# EAGLE design MicroMySens-v003 (EAGLE 7.3.0)
MAPLE-CUx Large Version
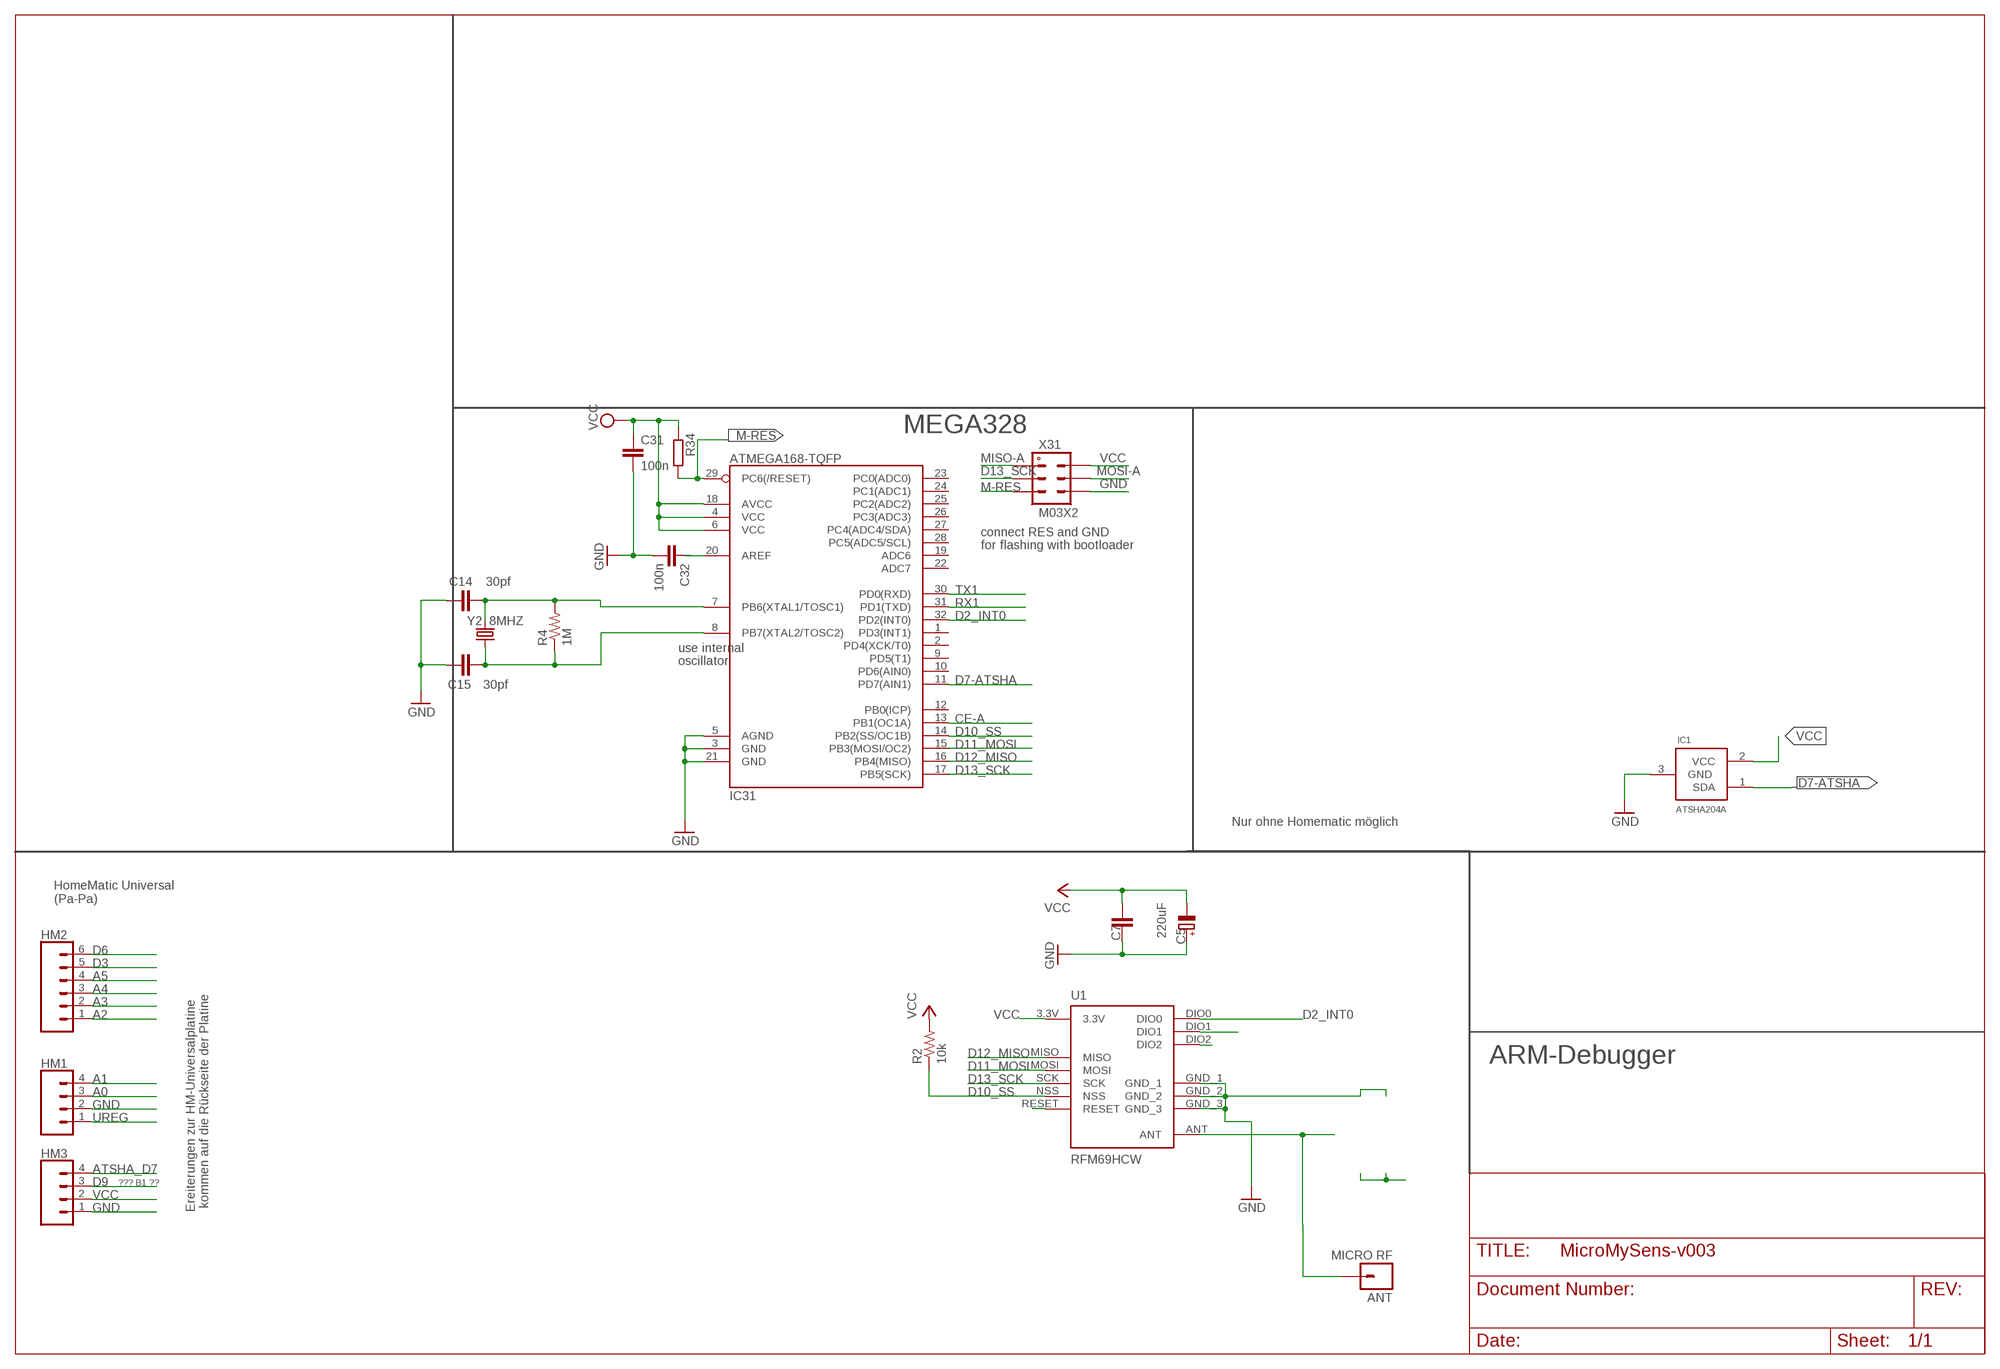
[diagram p0: schematic, sheet 1]

## Parts
ANT  MICRO RF  M01PTH  [1X01]
C5  220uF  CPOL-EUE5-8.5  [E5-8,5]
C7  C-EUC1812  [C1812]
C14  30pf  CAP0805  [0805]
C15  30pf  CAP0805  [0805]
C31  100n  C-EUC0805  [C0805]
C32  100n  C-EUC0805  [C0805]
HM1  CONN_04  [1X04]
HM2  CONN_06SILK_FEMALE_PTH  [1X06]
HM3  CONN_04  [1X04]
IC1  ATSHA204A  [SOT23]
IC31  ATMEGA168-TQFP  [TQFP32-08]
R2  10k  RESISTOR0805-RES  [0805]
R4  1M  RESISTOR0805-RES  [0805]
R34  R-EU_R0805  [R0805]
U1  RFM69HCW  [RFM69HCW-XXXS2]
X31  M03X2  [2X03-1.27MM_SMD]
Y2  8MHZ  CRYSTALTXC-7A  [CRYSTAL-TXC-7A]

## Nets
A0: HM1.3
A1: HM1.4
A2: HM2.1
A3: HM2.2
A4: HM2.3
A5: HM2.4
ANT: ANT.1 U1.ANT
ATSHA_D7: HM3.4
CE-A: IC31.13(PB1(OC1A))
D2_INT0: IC31.32(PD2(INT0)) U1.DIO0
D3: HM2.5
D6: HM2.6
D7-ATSHA: IC1.1(SDA) IC31.11(PD7(AIN1))
D9: HM3.3
D10_SS: IC31.14(PB2(SS/OC1B)) R2.1 U1.NSS
D11_MOSI: IC31.15(PB3(MOSI/OC2)) U1.MOSI
D12_MISO: IC31.16(PB4(MISO)) U1.MISO
D13_SCK: IC31.17(PB5(SCK)) U1.SCK X31.P$3
GND [PWR]: C5.+ C7.2 C14.1 C15.1 C31.2 C32.2 HM1.2 HM3.1 IC1.3(GND) IC31.3(GND) IC31.5(AGND) IC31.21(GND) U1.GND_1 U1.GND_2 U1.GND_3 X31.P$6
M-RES: IC31.29(PC6(/RESET)) R34.2 X31.P$5
MISO-A: X31.P$1
MOSI-A: X31.P$4
N$3: C14.2 IC31.7(PB6(XTAL1/TOSC1)) R4.2 Y2.P$2
N$13: C32.1 IC31.20(AREF)
N$14: U1.DIO2
N$15: U1.DIO1
N$16: U1.RESET
N$19: C15.2 IC31.8(PB7(XTAL2/TOSC2)) R4.1 Y2.P$1
RX1: IC31.31(PD1(TXD))
TX1: IC31.30(PD0(RXD))
UREG [PWR]: HM1.1
VCC [PWR]: C5.- C7.1 C31.1 HM3.2 IC1.2(VCC) IC31.4(VCC) IC31.6(VCC) IC31.18(AVCC) R2.2 R34.1 U1.3.3V X31.P$2
Unconnected: IC31.1(PD3(INT1)) IC31.2(PD4(XCK/T0)) IC31.9(PD5(T1)) IC31.10(PD6(AIN0)) IC31.12(PB0(ICP)) IC31.19(ADC6) IC31.22(ADC7) IC31.23(PC0(ADC0)) IC31.24(PC1(ADC1)) IC31.25(PC2(ADC2)) IC31.26(PC3(ADC3)) IC31.27(PC4(ADC4/SDA)) IC31.28(PC5(ADC5/SCL))

## Notes on the sheet
- MEGA328
- connect RES and GND
- for flashing with bootloader
- use internal
- oscillator
- Nur ohne Homematic möglich
- HomeMatic Universal
  (Pa-Pa)
- ARM-Debugger
- ??? B1 ??
- Ereiterungen zur HM-Universalplatine
   kommen auf die Rückseite der Platine

## Library data of the parts
ANT = SparkFun-Connectors:M01: Header 1 Standard 1-pin 0.1" header. Use with straight break away headers (SKU : PRT-00116), right angle break away headers (PRT-00553), swiss pins (PRT-00743), machine pins (PRT-00117), and female headers (PRT-00115).
C5 = rcl:CPOL-EU: POLARIZED CAPACITOR, European symbol
C7 C31 C32 = rcl:C-EU: CAPACITOR, European symbol
C14 C15 = doug:CAP: Capacitor Standard 0603 ceramic capacitor, and 0.1" leaded capacitor.
HM1 HM3 = SparkFun-Connectors:CONN_04: Multi connection point. Often used as Generic Header-pin footprint for 0.1 inch spaced/style header connections On any of the 0.1 inch spaced packages, you can populate with these: Break Away Headers - Straight <https://www.sparkfun.com/products/116> (PRT-00116) Break Away Male Headers - Right Angle <https://www.sparkfun.com/products/553> (PRT-00553) Female Headers <https://www.sparkfun.com/products/115> (PRT-00115) Break Away Headers - Machine Pin <https://www.sparkfun.com/products/117> (PRT-00117) Break Away Female Headers - Swiss Machine Pin <https://www.sparkfun.com/products/743> (PRT-00743) For SCREWTERMINALS and SPRING TERMINALS visit here: Screw Terimnals on SparkFun.com <https://www.sparkfun.com/search/results?term=Screw+Terminals> (5mm/3.5mm/2.54mm spacing) This device is also useful as a general connection point to wire up your design to another part of your project. Our various solder wires solder well into these plated through hole pads. Hook-Up Wire - Assortment (Stranded, 22 AWG) <https://www.sparkfun.com/products/11375> (PRT-11375) Hook-Up Wire - Assortment (Solid Core, 22 AWG) <https://www.sparkfun.com/products/11367> (PRT-11367) View the entire wire category on our website here <https://www.sparkfun.com/categories/141> Special notes: Molex polarized connector foot print use with SKU : PRT-08231 with associated crimp pins and housings. 1MM SMD Version SKU: PRT-10208; PROD_ID: CONN-09696
HM2 = SparkFun-Connectors:CONN_06: Multi connection point. Often used as Generic Header-pin footprint for 0.1 inch spaced/style header connections On any of the 0.1 inch spaced packages, you can populate with these: Break Away Headers - Straight <https://www.sparkfun.com/products/116> (PRT-00116) Break Away Male Headers - Right Angle <https://www.sparkfun.com/products/553> (PRT-00553) Female Headers <https://www.sparkfun.com/products/115> (PRT-00115) Break Away Headers - Machine Pin <https://www.sparkfun.com/products/117> (PRT-00117) Break Away Female Headers - Swiss Machine Pin <https://www.sparkfun.com/products/743> (PRT-00743) Arduino Stackable Header - 6 Pin <https://www.sparkfun.com/products/9280> (PRT-09280) For SCREWTERMINALS and SPRING TERMINALS visit here: Screw Terimnals on SparkFun.com <https://www.sparkfun.com/search/results?term=Screw+Terminals> (5mm/3.5mm/2.54mm spacing) This device is also useful as a general connection point to wire up your design to another part of your project. Our various solder wires solder well into these plated through hole pads. Hook-Up Wire - Assortment (Stranded, 22 AWG) <https://www.sparkfun.com/products/11375> (PRT-11375) Hook-Up Wire - Assortment (Solid Core, 22 AWG) <https://www.sparkfun.com/products/11367> (PRT-11367) View the entire wire category on our website here <https://www.sparkfun.com/categories/141>; PROD_ID: CONN-08437
IC1 = Sensor:ATSHA204A
IC31 = atmel:ATMEGA168: Atmel Atmega 168/328/328P
R2 R4 = doug:RESISTOR: Resistor Basic schematic elements and footprints for 0603, 1206, and PTH resistors.
R34 = rcl:R-EU_: RESISTOR, European symbol
U1 = doug:RFM69H
X31 = mechanics:M03X2
Y2 = SparkFun-FreqCtrl:CRYSTAL: Various standard crystals. Proven footprints.

## Net classes
0 default: width 0.305 mm
1 PWR: width 0.457 mm

## Board
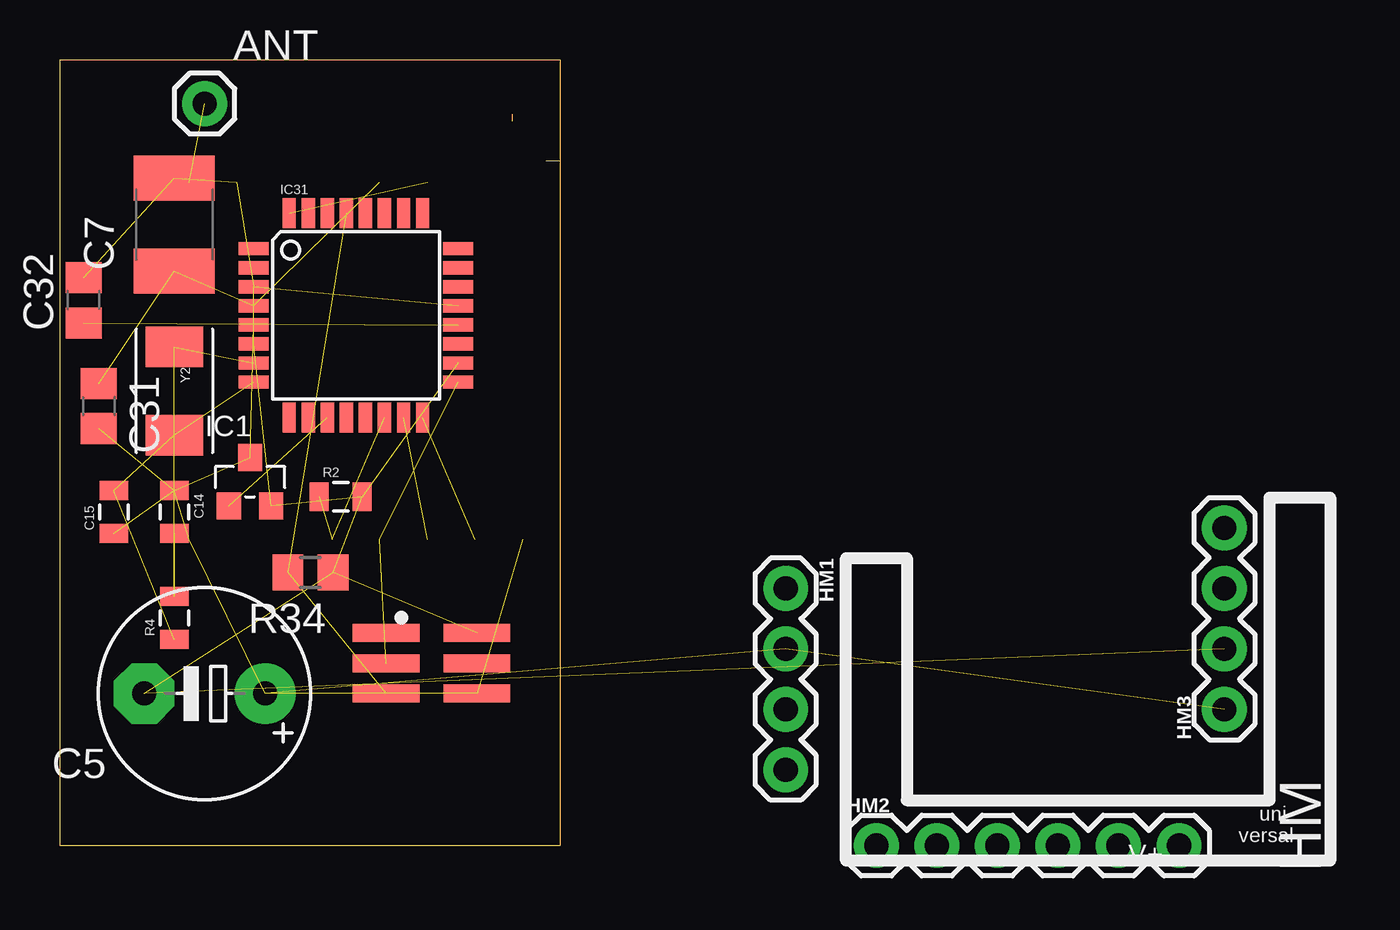
[diagram p1: board, top side]
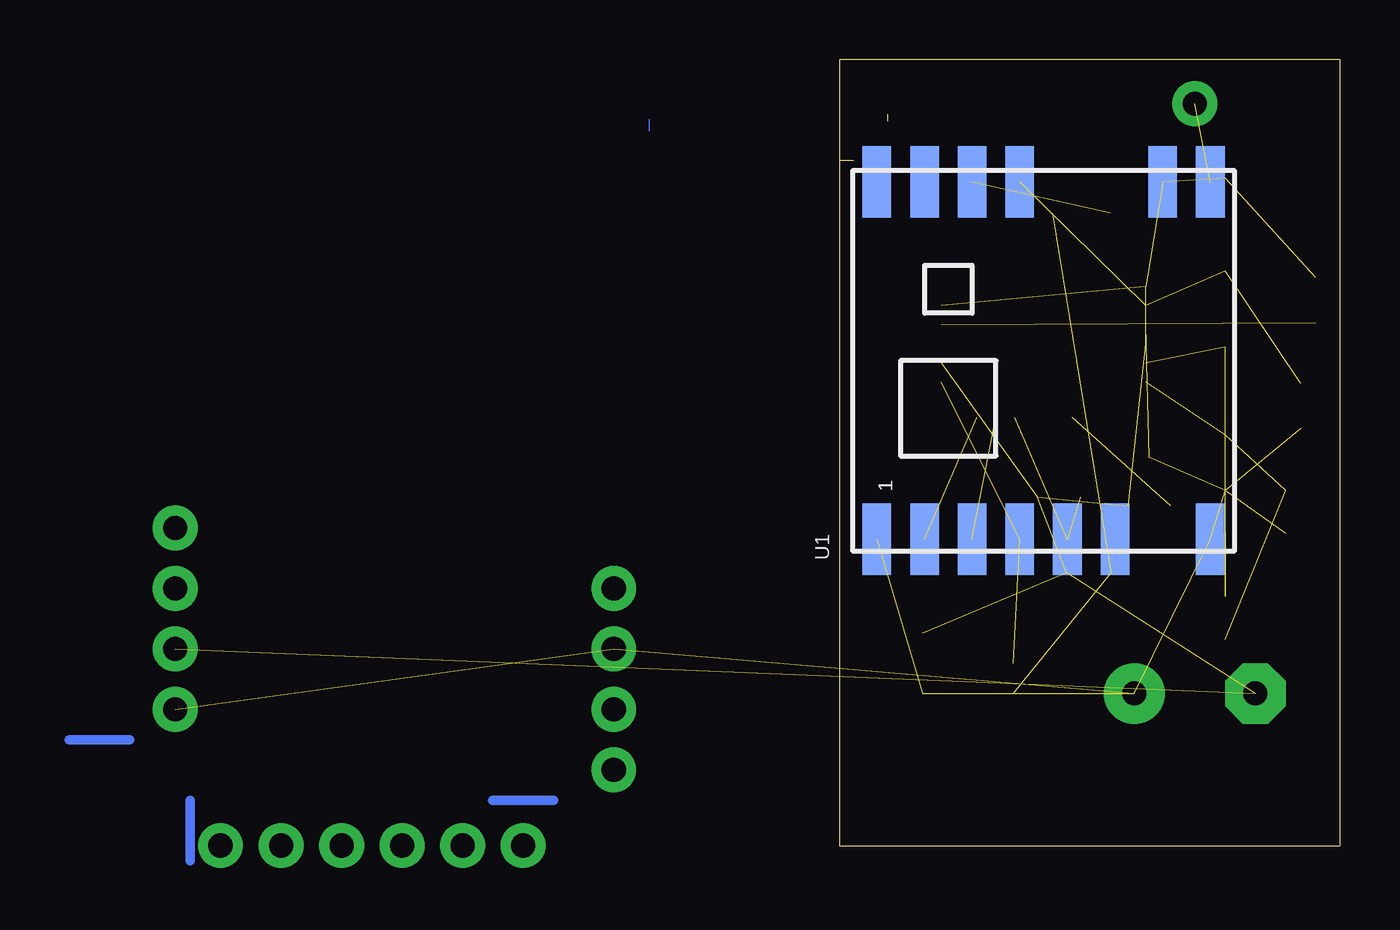
[diagram p2: board, bottom side, seen from below]

Size 21 x 33 mm. Coordinates in mm from the lower left corner, seen from the top.
Outline: 21,33 21,32.24
Outline: 19,30.7 19,30.41
Outline: 20.41,28.75 21,28.75
Outline: 21,33 0,33 0,0 21,0 21,28.75
Outline: 21,33 21,28.75
Copper layers (1*16): Top 0.035mm / dielectric 1.5mm / Bottom 0.035mm
Design rules "SeeedStudio_2layer_DRU_no_angle_20140221": minimum track width 6mil, minimum drill 12mil, track to track 6mil, track to pad 6mil, pad to pad 6mil, via to via 6mil, smd to smd 0mil, copper to edge 10mil, drill to drill 10mil, minimum pad ring 10mil, minimum via ring 6mil, stop-mask expansion 2mil, vias tented up to drill 100mil, thermal gap 10mil

### Footprints (pad centres in the part's own frame; a part is rotated, then mirrored left to right if it is on the bottom)
1X01 = drill 1.016 pad 1.88: 1 0,0
E5-8,5 = drill 1.016 pad 2.54: + -2.54,0 | drill 1.016 pad 2.54 octagon: - 2.54,0
C1812 = smd 1.9 x 3.4: 1 -1.95,0; 2 1.95,0
0805 = smd 0.8 x 1.2: 1 -0.9,0; 2 0.9,0
C0805 = smd 1.3 x 1.5: 1 -0.95,0; 2 0.95,0
1X04 = drill 1.016 pad 1.88: 1 0,0; 2 2.54,0; 3 5.08,0; 4 7.62,0
1X06 = drill 1.016 pad 1.88: 1 0,0; 2 2.54,0; 3 5.08,0; 4 7.62,0; 5 10.16,0; 6 12.7,0
SOT23 = smd 1.016 x 1.143: 1 -0.889,-1.016; 2 0.889,-1.016; 3 0,1.016
TQFP32-08 = smd 1.27 x 0.559: 1 -4.293,2.8; 2 -4.293,2; 3 -4.293,1.2; 4 -4.293,0.4; 5 -4.293,-0.4; 6 -4.293,-1.2; 7 -4.293,-2; 8 -4.293,-2.8; 17 4.293,-2.8; 18 4.293,-2; 19 4.293,-1.2; 20 4.293,-0.4; 21 4.293,0.4; 22 4.293,1.2; 23 4.293,2; 24 4.293,2.8 | smd 0.559 x 1.27: 9 -2.8,-4.293; 10 -2,-4.293; 11 -1.2,-4.293; 12 -0.4,-4.293; 13 0.4,-4.293; 14 1.2,-4.293; 15 2,-4.293; 16 2.8,-4.293; 25 2.8,4.293; 26 2,4.293; 27 1.2,4.293; 28 0.4,4.293; 29 -0.4,4.293; 30 -1.2,4.293; 31 -2,4.293; 32 -2.8,4.293
R0805 = smd 1.3 x 1.5: 1 -0.95,0; 2 0.95,0
RFM69HCW-XXXS2 = smd 3 x 1.2: 3.3V 7.5,1; ANT 7.5,-7; DIO0 7.5,3; DIO1 7.5,5; DIO2 7.5,7; GND_1 7.5,-5; GND_2 -7.5,-7; GND_3 -7.5,7; MISO -7.5,5; MOSI -7.5,3; NSS -7.5,-1; RESET -7.5,-3; SCK -7.5,1
2X03-1.27MM_SMD = smd 0.75 x 2.8: P$1 -1.27,-1.905; P$2 -1.27,1.905; P$3 0,-1.905; P$4 0,1.905; P$5 1.27,-1.905; P$6 1.27,1.905
CRYSTAL-TXC-7A = smd 1.7 x 2.4: P$1 1.85,0; P$2 -1.85,0

### Placement (x,y rotation side)
ANT  6.09,31.15 0 top
C5  6.09,6.38 180 top
C7  4.82,26.07 90 top
C14  4.82,14.01 270 top
C15  2.28,14.01 90 top
C31  1.65,18.45 270 top
C32  1.01,22.89 90 top
HM1  30.48,10.79 270 top  (outside the outline)
HM2  34.29,0 0 top  (outside the outline)
HM3  48.9,5.71 90 top  (outside the outline)
IC1  8,15.28 0 top
IC31  12.44,22.26 0 top
R2  11.8,14.64 0 top
R4  4.82,9.56 90 top
R34  10.54,11.46 180 top
U1  12.44,20.36 90 bottom
X31  15.62,7.66 270 top
Y2  4.82,19.09 270 top

### Tracks (layer width: path | path; a pad name or v marks a point on that pad's centre or on a via)
ANT  (1 unrouted)
D2_INT0  (1 unrouted)
D7-ATSHA  (1 unrouted)
D10_SS  (2 unrouted)
D11_MOSI  (1 unrouted)
D12_MISO  (1 unrouted)
D13_SCK  (2 unrouted)
GND  (15 unrouted)
M-RES  (2 unrouted)
N$2
  Bottom 0.406: 35.56,1.91 33.02,1.91
N$3  (3 unrouted)
N$4
  Bottom 0.406: 48.26,1.91 48.26,-0.64
N$5
  Bottom 0: 29,30.5 29,30
N$6
  Bottom 0.406: 50.8,4.45 53.34,4.45
N$13  (1 unrouted)
N$19  (3 unrouted)
VCC  (11 unrouted)

### Text on the board
tPlace: HM | uni- / versal
tNames: V+